# Altium schematic sheet sepic.SchDoc: SION SEPIC v2 Prototype
size A4; Organization: UNSW Solar Racing Team; Address3: UNSW; Address4: Sydney NSW 2052; Address2: Electrical Engineering; Address1: Room 342
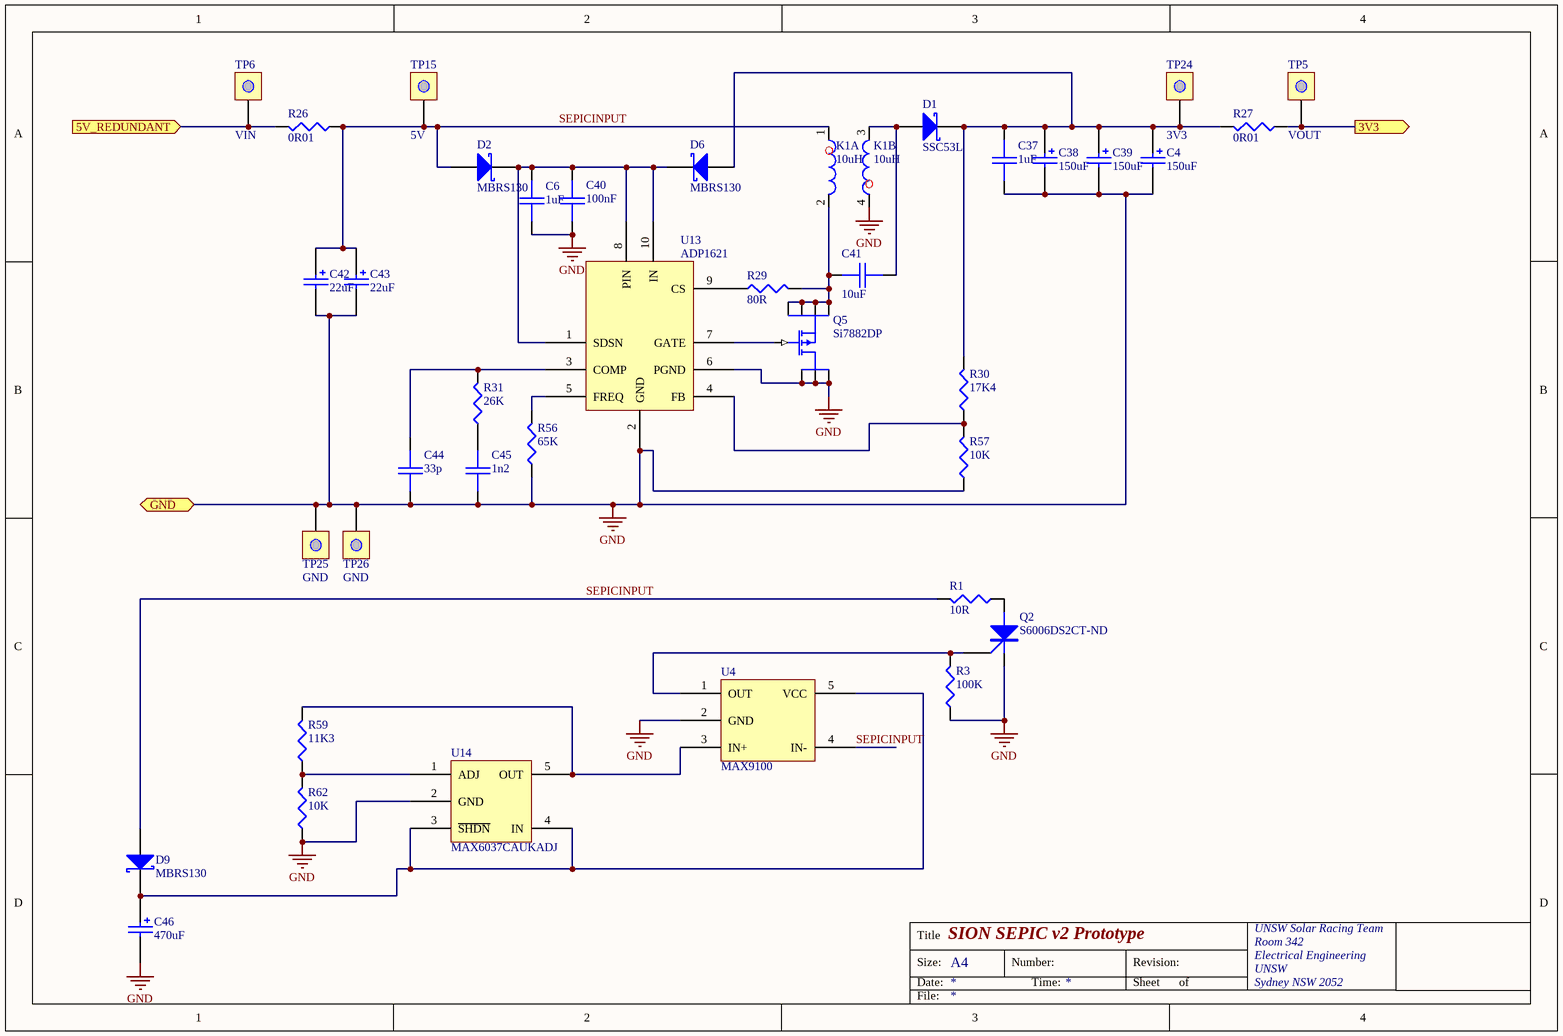
[diagram p0: sepic.SchDoc]

## Parts
C4  150uF  [MCCT-CASED]
C6  1uF  [0805]
C37  1uF  [0805]
C38  150uF  [MCCT-CASED]
C39  150uF  [MCCT-CASED]
C40  100nF  [0603]
C41  10uF  [0805]
C42  22uF  [MCCT-CASEB]
C43  22uF  [MCCT-CASEB]
C44  33p  [0603]
C45  1n2  [0603]
C46  470uF  [MCCT-CASED]
D1  SSC53L  [SMC]
D2  MBRS130  [SMB]
D6  MBRS130  [SMB]
D9  MBRS130  [SMB]
K1  10uH  [CTX2]  (parts A,B of 2)
Q2  S6006DS2CT-ND  [DPAK_N-MOSFET]
Q5  Si7882DP  [SO8]
R1  10R  [DIODE0.7]
R3  100K  [1206]
R26  0R01  [1206]
R27  0R01  [1206]
R29  80R  [0603]
R30  17K4  [1206]
R31  26K  [1206]
R56  65K  [0603]
R57  10K  [1206]
R59  11K3  [1206]
R62  10K  [1206]
TP5  VOUT  [TESTPOINT]
TP6  VIN  [TESTPOINT]
TP15  5V  [TESTPOINT]
TP24  3V3  [TESTPOINT]
TP25  GND  [TESTPOINT]
TP26  GND  [TESTPOINT]
U4  MAX9100  [SOT23-5]
U13  ADP1621  [MSOP10]
U14  MAX6037CAUKADJ  [SOT23-5]

## Ports
3V3 (out), 5V_REDUNDANT (in), GND

## Nets
GND: C4.2 C6.2 C37.2 C38.2 C39.2 C40.1 C42.2 C43.2 C44.2 C45.2 C46.2 K1.4 Q2.1(K) Q5.1(S) Q5.2(S) Q5.3(S) R3.1 R56.1 R57.1 R62.1 TP25.0(TP) TP26.0(TP) U4.2(GND) U13.2(GND) U13.6(PGND) U14.2(GND) ; port GND
3V3: R27.1 TP5.0(TP) ; port 3V3
5V_REDUNDANT: R26.2 TP6.0(TP) ; port 5V_REDUNDANT
SEPICINPUT: C42.1 C43.1 D2.A D9.A K1.1 R1.2 R26.1 TP15.0(TP) U4.4(IN-)
NetC4_1: C4.1 C37.1 C38.1 C39.1 D1.K D6.A R27.2 R30.2 TP24.0(TP)
NetC6_1: C6.1 C40.2 D2.K D6.K U13.1(SDSN) U13.8(PIN) U13.10(IN)
NetC41_1: C41.1 K1.2 Q5.5(D) Q5.6(D) Q5.7(D) Q5.8(D) R29.2
NetC41_2: C41.2 D1.A K1.3
NetC44_1: C44.1 R31.2 U13.3(COMP)
NetC45_1: C45.1 R31.1
NetC46_1: C46.1 D9.K U4.5(VCC) U14.3(~{SHDN}) U14.4(IN)
NetQ2_2: Q2.2(A) R1.1
NetQ2_3: Q2.3(G) R3.2 U4.1(OUT)
NetQ5_4: Q5.4(G) U13.7(GATE)
NetR29_1: R29.1 U13.9(CS)
NetR30_1: R30.1 R57.2 U13.4(FB)
NetR56_2: R56.2 U13.5(FREQ)
NetR59_1: R59.1 R62.2 U14.1(ADJ)
NetR59_2: R59.2 U4.3(IN+) U14.5(OUT)

## Notes on the sheet
- Title
- Size:
- Date:
- A4
- Number:
- Time:
- Revision:
- Sheet
- of
- File:

## Library data of the parts
C4 C38 C39 C42 C43 C46 = CAP POL3: Polarized Capacitor (Surface Mount); Manufacturer: Generic Components; Class I: Passive; Value: 100pF; Published: 8-Jun-2000; Revision: July-2002: Re-released for DXP Platform.; Publisher: Altium Limited; Class II: Capacitor
  C4 C38 C39: Farnell: 1754096; FarnellPrice: 2.97
  C42 C43: Farnell: 1457447; FarnellPrice: 1.06
  C46: Digikey: 718-1780-1-ND
C6 C37 C40 C44 C45 = CAP: Capacitor
  C6 C37: Farnell: 1683651; FarnellPrice: 0.05
  C44: Farnell: 1816801; FarnellPrice: 0.05
  C45: Farnell: 3019664; FarnellPrice: 0.167
C41 = CAP: grm21br61a106k; Farnell: 1828805; FarnellPrice: 0.448
D1 D2 D6 D9 = D SCHOTTKY: Schottky Diode; Manufacturer: Generic Components; Class I: Discrete; Class II: Diode - Schottky; Published: 8-Jun-2000; Revision: July-2002: Re-released for DXP Platform.; Publisher: Altium Limited
  D1: Farnell: 1336558; FarnellPrice: 2.64
  D2 D6 D9: Farnell: 9556931; FarnellPrice: 0.43
K1 = CTX10-2-R: Coupled Power Inductor; Farnell: 1194198; Price: 8.53
Q2 = SCR: Sensitive SCR; Digikey: S6006DS2CT-ND
Q5 = Si7882DP: Power N mosfet; Farnell: 1470159; FarnellPrice: 5.15
R1 R3 R26 R27 R29-R31 R56 R57 R59 R62 = RES1: Resistor
  R1: Farnell: 1357872; FarnellPrice: 0.119
  R3 R57: Farnell: 1469669; FarnellPrice: 0.02
  R26 R27: Farnell: 8067520; FarnellPrice: 0.616
  R29: Farnell: 1644187; FarnellPrice: 0.075
  R30: Farnell: 1152720; FarnellPrice: 0.02
  R31: Farnell: 1152861; FarnellPrice: 0.02
  R56: Farnell: 1633712; FarnellPrice: 0.01
  R59: Digikey: RNCF1206BKC11K3CT-ND
  R62: Digikey: CRT1206-BY-1002ELFCT-ND
TP5 TP6 TP15 TP24-TP26 = TEST: TEST POINT
U4 = MAX9100EUK: Micropower comparator; Digikey: MAX9100EUK+TCT-ND
U13 = ADP1621: SEPIC / Boost Controller; Digikey: ADP1621ARMZ-R7CT-ND; DigikeyPrice: 2.97; Farnell: 1461500; FarnellPrice: 5.27
U14 = MAX6037CAUKADJ: Adjustable voltage reference; Digikey: MAX6037CAUKADJ+TCT-ND; DigikeyPrice: 2.05